# Altium schematic sheet DIY_DAP_PCB_PIC32.SchDoc: DIY_DAP_PCB_PIC32
size A4; Revision: A; SheetNumber: 1; SheetTotal: 4
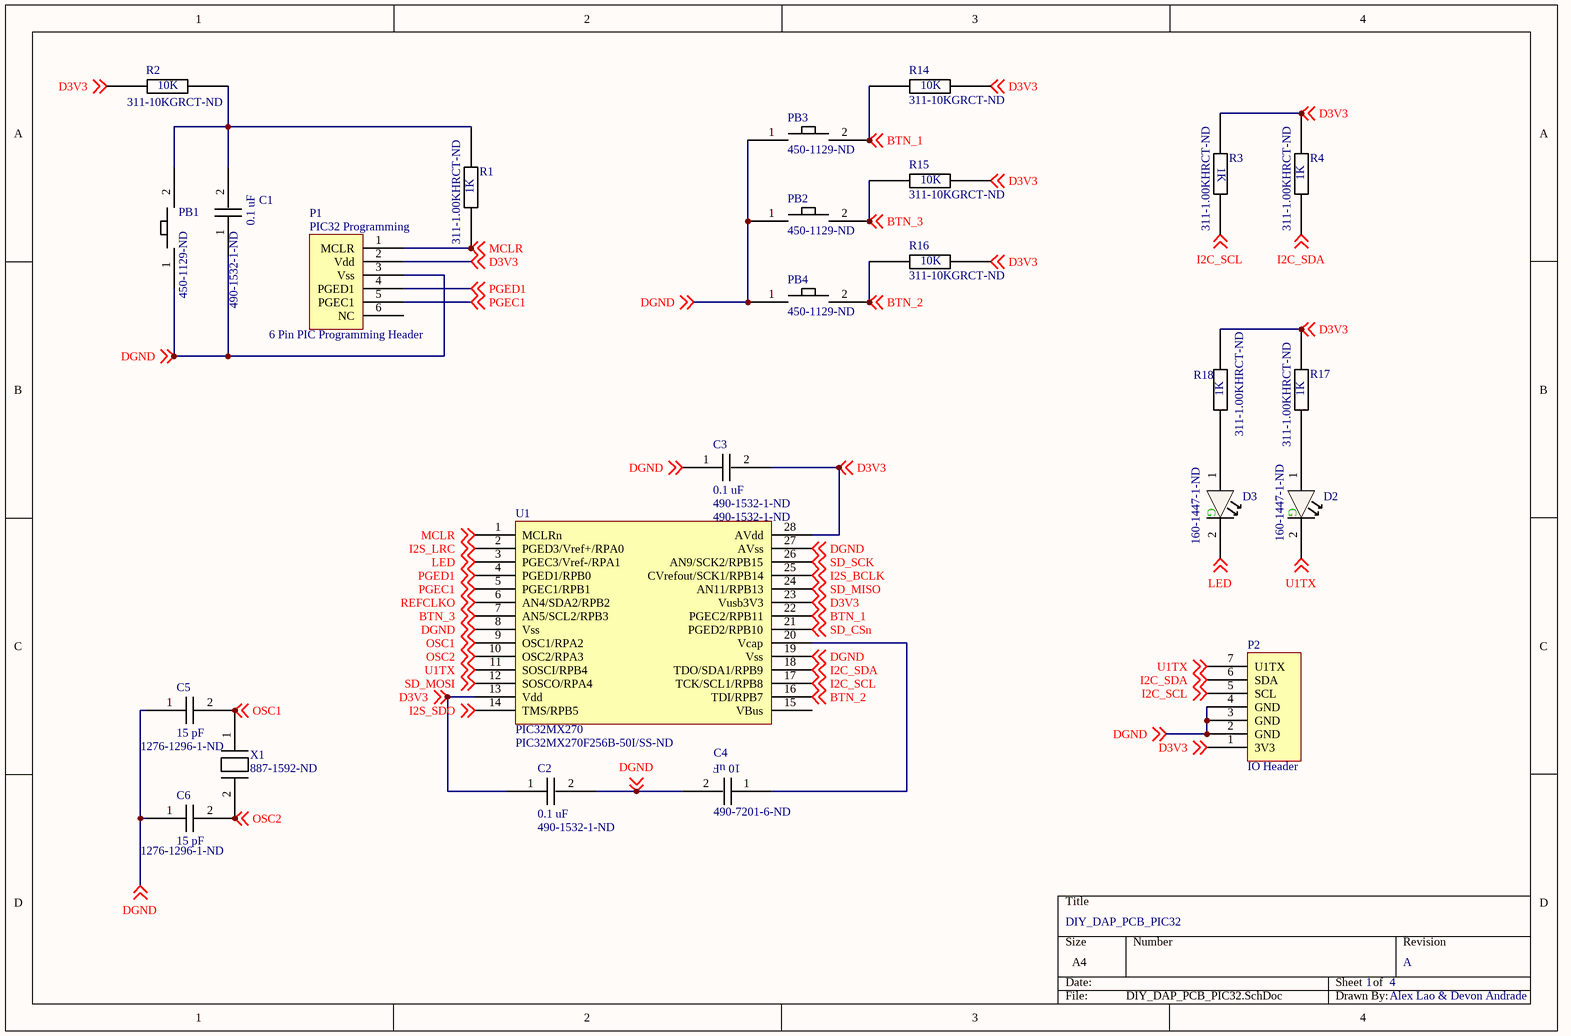
[diagram p0: DIY_DAP_PCB_PIC32.SchDoc]

## Parts
C1  490-1532-1-ND  [0603]
C2  490-1532-1-ND  [0603]
C3  490-1532-1-ND  [0603]
C4  490-7201-6-ND  [0603]
C5  1276-1296-1-ND  [0603]
C6  1276-1296-1-ND  [0603]
D2  160-1447-1-ND  [0603]
D3  160-1447-1-ND  [0603]
P1  6 Pin PIC Programming Header  [PIC32 Programming Header]
P2  IO Header  [IO Header]
PB1  450-1129-ND  [450-1129-ND]
PB2  450-1129-ND  [450-1129-ND]
PB3  450-1129-ND  [450-1129-ND]
PB4  450-1129-ND  [450-1129-ND]
R1  311-1.00KHRCT-ND  [0603]
R2  311-10KGRCT-ND  [0603]
R3  311-1.00KHRCT-ND  [0603]
R4  311-1.00KHRCT-ND  [0603]
R14  311-10KGRCT-ND  [0603]
R15  311-10KGRCT-ND  [0603]
R16  311-10KGRCT-ND  [0603]
R17  311-1.00KHRCT-ND  [0603]
R18  311-1.00KHRCT-ND  [0603]
U1  PIC32MX270  [PIC32MX270F256B-50I/SS-ND]
X1  887-1592-ND  [887-1592-ND]

## Nets
BTN_1: PB3.2 R14.1 U1.22(PGEC2/RPB11) ; off-sheet BTN_1
BTN_2: PB4.2 R16.1 U1.16(TDI/RPB7) ; off-sheet BTN_2
BTN_3: PB2.2 R15.1 U1.7(AN5/SCL2/RPB3) ; off-sheet BTN_3
D3V3: C2.1 C3.2 P1.2(Vdd) P2.1(3V3) R2.1 R3.1 R4.2 R14.2 R15.2 R16.2 R17.2 R18.2 U1.13(Vdd) U1.23(Vusb3V3) U1.28(AVdd) ; off-sheet D3V3
DGND: C1.1 C2.2 C3.1 C4.2 C5.1 C6.1 P1.3(Vss) P2.2(GND) P2.3(GND) P2.4(GND) PB1.1 PB2.1 PB3.1 PB4.1 U1.8(Vss) U1.19(Vss) U1.27(AVss) ; off-sheet DGND
I2C_SCL: P2.5(SCL) R3.2 U1.17(TCK/SCL1/RPB8) ; off-sheet I2C_SCL
I2C_SDA: P2.6(SDA) R4.1 U1.18(TDO/SDA1/RPB9) ; off-sheet I2C_SDA
I2S_BCLK: U1.25(CVrefout/SCK1/RPB14) ; off-sheet I2S_BCLK
I2S_LRC: U1.2(PGED3/Vref+/RPA0) ; off-sheet I2S_LRC
I2S_SDO: U1.14(TMS/RPB5) ; off-sheet I2S_SDO
LED: D3.2(-) U1.3(PGEC3/Vref-/RPA1) ; off-sheet LED
MCLR: P1.1(MCLR) R1.1 U1.1(MCLRn) ; off-sheet MCLR
OSC1: C5.2 U1.9(OSC1/RPA2) X1.1 ; off-sheet OSC1
OSC2: C6.2 U1.10(OSC2/RPA3) X1.2 ; off-sheet OSC2
PGEC1: P1.5(PGEC1) U1.5(PGEC1/RPB1) ; off-sheet PGEC1
PGED1: P1.4(PGED1) U1.4(PGED1/RPB0) ; off-sheet PGED1
REFCLKO: U1.6(AN4/SDA2/RPB2) ; off-sheet REFCLKO
SD_CSn: U1.21(PGED2/RPB10) ; off-sheet SD_CSn
SD_MISO: U1.24(AN11/RPB13) ; off-sheet SD_MISO
SD_MOSI: U1.12(SOSCO/RPA4) ; off-sheet SD_MOSI
SD_SCK: U1.26(AN9/SCK2/RPB15) ; off-sheet SD_SCK
U1TX: D2.2(-) P2.7(U1TX) U1.11(SOSCI/RPB4) ; off-sheet U1TX
NetC1_2: C1.2 PB1.2 R1.2 R2.2
NetC4_1: C4.1 U1.20(Vcap)
NetD2_1: D2.1(+) R17.1
NetD3_1: D3.1(+) R18.1

Not connected (* = marked no-connect by the designer): P1 6(NC); U1 15(VBus)

## Notes on the sheet
- Alex Lao & Devon Andrade
- (in symbol 6 Pin PIC Programming Header) PIC32 Programming
- (in symbol 160-1447-1-ND) G
- (in symbol 311-1.00KHRCT-ND) 1K
- (in symbol 311-10KGRCT-ND) 10K
- (in symbol 490-1532-1-ND) 0.1 uF
- (in symbol 490-7201-6-ND) 10 uF
- (in symbol 1276-1296-1-ND) 15 pF

## Library data of the parts
C1-C3 = 490-1532-1-ND: 0603 0.1 uF - 16V - Ceramic Capacitor; Supplier 1: Digi-Key
  C3: Supplier Part Number 1: 490-1532-1-ND
C4 = 490-7201-6-ND: 0603 10 uF - 16V - Ceramic Capacitor; Supplier 1: Digi-Key
C5 C6 = 1276-1296-1-ND: 0603 15 pF - 50V - Ceramic Capacitor; Supplier 1: Digi-Key
D2 D3 = 160-1447-1-ND: Green LED (0603); Supplier 1: Digi-Key
PB1-PB4 = 450-1129-ND: Momentary Push button; Supplier 1: Digi-Key
R1 R3 R4 R17 R18 = 311-1.00KHRCT-ND: 1k Ohm Resistor; Supplier 1: Digi-Key
R2 R14-R16 = 311-10KGRCT-ND: 10k Ohm Resistor; Supplier 1: Digi-Key
U1 = PIC32MX270F256B-50I/SS-ND: PIC32MX270F256B; Supplier 1: Digi-Key; Supplier Part Number 1: PIC32MX270F256B-50I/SS-ND
X1 = 887-1592-ND: 16.9344 Mhz Crystal; Supplier 1: Digi-Key